# EAGLE design Smartwatch-EXTRA-AUX1 (EAGLE 9.6.2)
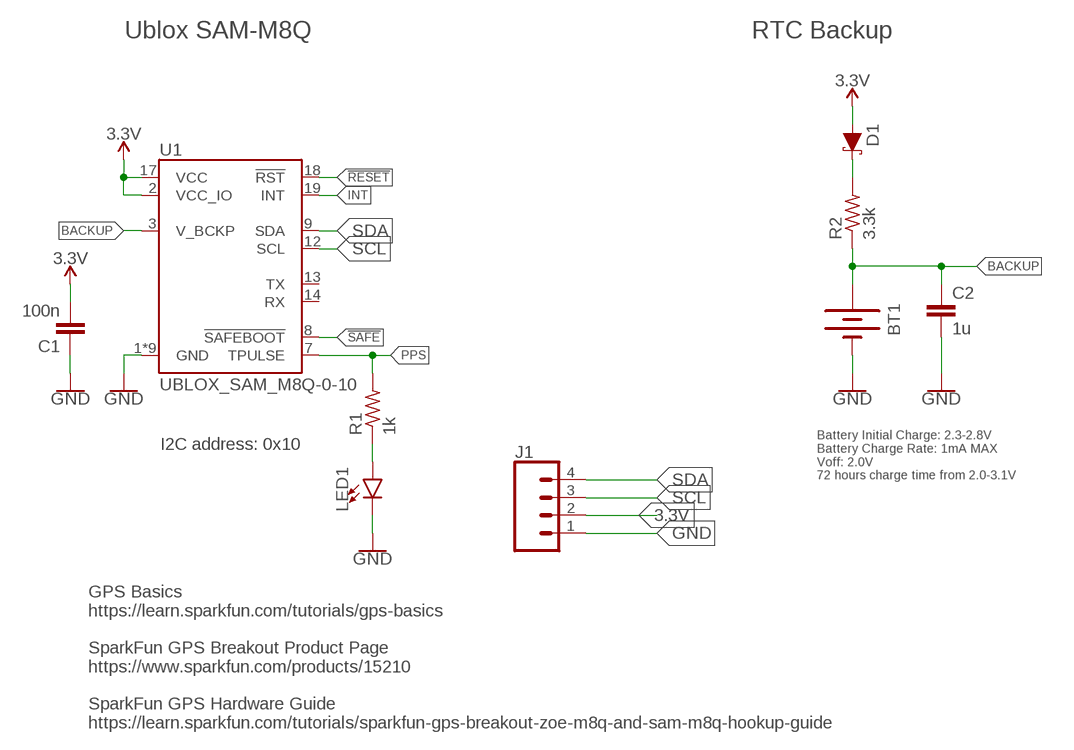
[diagram p0: schematic, sheet 1]

## Parts
BT1  ML414H_IV01E_BATTERY  [ML414H_IV01E]
C1  100n  CAPACITOR0603  [C0603]
C2  1u  CAPACITOR0603  [C0603]
D1  SCHOTTKY-USC  [USC]
J1  CONN_041.27MM  [1X04_1.27MM]
LED1  LED0603  [LED-0603]
R1  1k  RESISTOR0603  [R0603]
R2  3.3k  RESISTOR0603  [R0603]
U1  UBLOX_SAM_M8Q-0-10  [SAM-M8Q]

## Nets
3.3V: C1.2 D1.+(A) J1.2 U1.2(VCC_IO) U1.17(VCC)
!RESET: U1.18(!RST)
!SAFE: U1.8(!SAFEBOOT)
BACKUP: BT1.+ C2.1 R2.1 U1.3(V_BCKP)
GND: BT1.- C1.1 C2.2 J1.1 LED1.C U1.1(GND) U1.4(GND) U1.5(GND) U1.6(GND) U1.10(GND) U1.11(GND) U1.15(GND) U1.16(GND) U1.20(GND)
INT: U1.19(INT)
N$1: D1.-(C) R2.2
N$2: LED1.A R1.1
PPS: R1.2 U1.7(TPULSE)
SCL: J1.3 U1.12(SCL)
SDA: J1.4 U1.9(SDA)
Unconnected: U1.13(TX) U1.14(RX)

## Notes on the sheet
- Ublox SAM-M8Q | RTC Backup
- I2C address: 0x10
- Battery Initial Charge: 2.3-2.8V
  Battery Charge Rate: 1mA MAX
  Voff: 2.0V
  72 hours charge time from 2.0-3.1V
- GPS Basics
  https://learn.sparkfun.com/tutorials/gps-basics
  
  SparkFun GPS Breakout Product Page
  https://www.sparkfun.com/products/15210
  
  SparkFun GPS Hardware Guide
  https://learn.sparkfun.com/tutorials/sparkfun-gps-breakout-zoe-m8q-and-sam-m8q-hookup-guide

## Library data of the parts
BT1 = LinnesLab-Batteries:ML414H_IV01E_BATTERY: SEIKO ML414H-IV01E Reflowable Lithium Battery ML414H is a rechargeable, coin type battery with features such as Pb-free reflowable (Peak temperature: 260 C) and high temperature heat resistance. Battery Characteristics: 3.1V max voltage Voff is 2V 1mAH 3k series resistor with battery 72 hour charge time from 2.0-3.1V 2.3-2.8V initial charge; DIGIKEY: 728-1052-1-ND; MANUFACTURER: Seiko Instruments; MF_NUMBER: ML414H IV01E
C1 C2 = LinnesLab-Passives:CAPACITOR
D1 = LinnesLab-DiscreteSemi:SCHOTTKY: Schottky diode A Schottky diode is a semiconductor diode which has a low forward voltage drop and a very fast switching action. Example: Digi-Key Part Number: RB161MM-20CT-ND
J1 = LinnesLab-Connectors:CONN_04: Multi connection point. Often used as Generic Header-pin footprint for 0.1 inch spaced/style header connections On any of the 0.1 inch spaced packages, you can populate with these: Break Away Headers - Straight <https://www.sparkfun.com/products/116> (PRT-00116) Break Away Male Headers - Right Angle <https://www.sparkfun.com/products/553> (PRT-00553) Female Headers <https://www.sparkfun.com/products/115> (PRT-00115) Break Away Headers - Machine Pin <https://www.sparkfun.com/products/117> (PRT-00117) Break Away Female Headers - Swiss Machine Pin <https://www.sparkfun.com/products/743> (PRT-00743) For SCREWTERMINALS and SPRING TERMINALS visit here: Screw Terimnals on SparkFun.com <https://www.sparkfun.com/search/results?term=Screw+Terminals> (5mm/3.5mm/2.54mm spacing) This device is also useful as a general connection point to wire up your design to another part of your project. Our various solder wires solder well into these plated through hole pads. Hook-Up Wire - Assortment (Stranded, 22 AWG) <https://www.sparkfun.com/products/11375> (PRT-11375) Hook-Up Wire - Assortment (Solid Core, 22 AWG) <https://www.sparkfun.com/products/11367> (PRT-11367) View the entire wire category on our website here <https://www.sparkfun.com/categories/141> Special notes: Molex polarized connector foot print use with SKU : PRT-08231 with associated crimp pins and housings. 1MM SMD Version SKU: PRT-10208
LED1 = LinnesLab-LED:LED: LED (Generic) Standard schematic elements and footprints for 5mm, 3mm, 1206, and 0603 sized LEDs. Generic LEDs with no color specified. LTST-C190KGKT: arrow indicates cathode
R1 R2 = LinnesLab-Passives:RESISTOR
U1 = LinnesLab-Sensors:UBLOX_SAM_M8Q-0-10: u-blox SAM-M8Q The u-blox concurrent SAM-M8Q GNSS patch antenna module benefits from the exceptional performance of the u-blox M8 multi-GNSS engine. The SAM-M8Q module offers high sensitivity and minimal acquisition times in an ultra compact form factor. The SAM-M8Q module utilizes concurrent reception of up to three GNSS systems (GPS/Galileo and GLONASS), recognizes multiple constellations simultaneously and provides outstanding positioning accuracy in scenarios where urban canyon or weak signals are involved. For even better and faster positioning improvement, the SAM-M8Q supports augmentation of QZSS, GAGAN and IMES together with WAAS, EGNOS, MSAS. The SAM-M8Q also supports message integrity protection, geofencing, and spoofing detection with configurable interface settings to easily fit to customer applications.; DIGIKEY: 672-1054-1-ND; MANUFACTURER: U-Blox; MF_NUMBER: SAM-M8Q-0-10; PROD_ID: IC-14070

## Net classes
0 default: width 0.254 mm

## Board
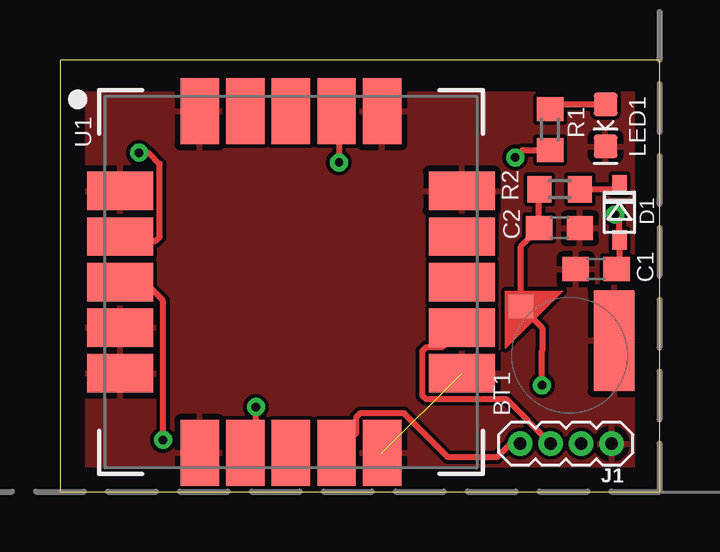
[diagram p1: board, top side]
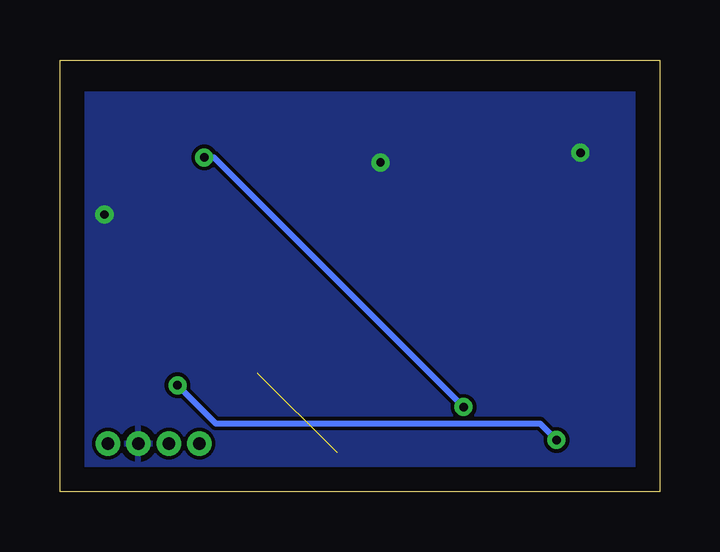
[diagram p2: board, bottom side, seen from below]

Size 25 x 18 mm. Coordinates in mm from the lower left corner, seen from the top.
Outline: 0,0 25,0 25,18 0,18 0,0
Copper layers (1*16): Top 0.035mm / dielectric 1.5mm / Bottom 0.035mm
Design rules "default": minimum track width 6mil, minimum drill 0.35mm, track to track 6mil, track to pad 6mil, pad to pad 6mil, via to via 6mil, smd to smd 6mil, copper to edge 40mil, drill to drill 6mil, minimum pad ring 10mil, minimum via ring 8mil, stop-mask expansion 4mil, vias tented up to drill 0mil, thermal gap 10mil

### Footprints (pad centres in the part's own frame; a part is rotated, then mirrored left to right if it is on the bottom)
ML414H_IV01E = smd 1 x 1: + 2.022,2.032 | smd 4.2 x 1.7: - 0.6,-1.85
C0603 = smd 1.1 x 1: 1 -0.85,0; 2 0.85,0
USC = smd 0.8 x 0.6: + -1.15,0; - 1.15,0
1X04_1.27MM = drill 0.508 pad 1: 1 0,0; 2 1.27,0; 3 2.54,0; 4 3.81,0
LED-0603 = smd 1 x 1: A -0.877,0; C 0.877,0
R0603 = smd 1 x 1.1: 1 -0.85,0; 2 0.85,0
SAM-M8Q = smd 2.75 x 1.6: 1 -7.125,3.8; 2 -7.125,1.9; 3 -7.125,0; 4 -7.125,-1.9; 5 -7.125,-3.8; 11 7.125,-3.8; 12 7.125,-1.9; 13 7.125,0; 14 7.125,1.9; 15 7.125,3.8 | smd 1.6 x 2.75: 6 -3.8,-7.125; 7 -1.9,-7.125; 8 0,-7.125; 9 1.9,-7.125; 10 3.8,-7.125; 16 3.8,7.125; 17 1.9,7.125; 18 0,7.125; 19 -1.9,7.125; 20 -3.8,7.125

### Placement (x,y rotation side)
BT1  21.26,5.69 90 top
C1  22.35,9.27 0 top
C2  20.83,10.99 0 top
D1  23.33,11.65 90 top
J1  23,2 180 top
LED1  22.75,15.27 270 top
R1  20.43,15.1 270 top
R2  20.84,12.61 0 top
U1  9.63,8.73 0 top

### Tracks (layer width: path | path; a pad name or v marks a point on that pad's centre or on a via)
3.3V  (via drill 0.35)
  Top 0.254: C1.2 23.33,9.4 D1.+ 23.33,11.37 v23.15,11.55 | U1.2 2.68,10.45 4,10.45 4.16,10.62 4.16,13.67 3.69,14.13 v3.3,14.13 | U1.17 11.63,15.75 v11.63,13.72
  pour Bottom: 0.8,16.62 24.38,16.62 24.38,0.31 0.8,0.31
BACKUP  (via drill 0.35)
  Top 0.254: R2.1 19.98,12.6 C2.1 19.23,10.24 BT1.+ 20.11,6.83 20.11,5.89 20.1,5.88 v20.1,4.43 | U1.3 3.53,8.73 4.3,7.97 v4.3,2.15
  Bottom 0.254: v4.3,2.15 4.98,2.84 18.5,2.84 v20.1,4.43
GND  (1 unrouted)
  pour Top: 0.77,16.62 24.38,16.62 24.38,0.28 0.77,0.28
N$1
  Top 0.254: R2.2 23.14,12.61 D1.-
N$2
  Top 0.254: R1.1 20.63,16.15 LED1.A
PPS  (via drill 0.35)
  Top 0.254: U1.7 8.17,2.05 v8.17,3.53 | v18.98,13.93 19.3,14.25 R1.2
  Bottom 0.254: v8.17,3.53 18.58,13.93 v18.98,13.93
SCL
  Top 0.254: 16.75,7.48 U1.12 15.93,6.01 15.26,6.01 15.1,5.85 15.1,4.02 15.26,3.85 18.61,3.85 J1.3
SDA
  Top 0.254: 11.53,2.59 U1.9 12.35,2.43 12.35,3.1 12.51,3.26 14.35,3.26 16.18,1.43 18.21,1.43 18.78,2 J1.4